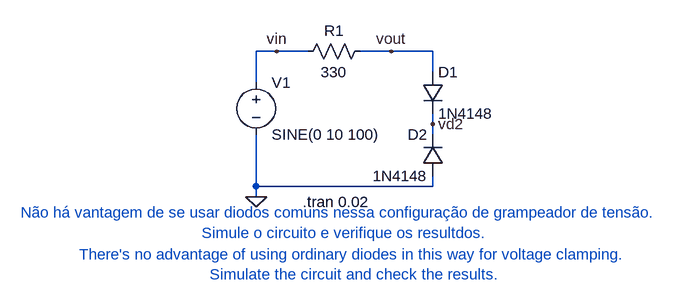
[diagram p0: schematic diodes_bad_voltage_clamp.asc]
diodes_bad_voltage_clamp.asc, the LTspice schematic file:
Version 4
SHEET 1 936 680
WIRE 112 48 80 48
WIRE 160 48 112 48
WIRE 288 48 240 48
WIRE 352 48 288 48
WIRE 352 80 352 48
WIRE 80 96 80 48
WIRE 352 160 352 144
WIRE 352 176 352 160
WIRE 80 256 80 176
WIRE 352 256 352 240
WIRE 352 256 80 256
WIRE 80 272 80 256
FLAG 80 272 0
FLAG 112 48 vin
FLAG 288 48 vout
FLAG 352 160 vd2
SYMBOL voltage 80 80 R0
WINDOW 123 0 0 Left 0
WINDOW 39 0 0 Left 0
SYMATTR InstName V1
SYMATTR Value SINE(0 10 100)
SYMBOL res 256 32 R90
WINDOW 0 0 56 VBottom 2
WINDOW 3 32 56 VTop 2
SYMATTR InstName R1
SYMATTR Value 330
SYMBOL diode 336 80 R0
SYMATTR InstName D1
SYMATTR Value 1N4148
SYMBOL diode 368 240 R180
WINDOW 0 24 64 Left 2
WINDOW 3 24 0 Left 2
SYMATTR InstName D2
SYMATTR Value 1N4148
TEXT 152 280 Left 2 !.tran 0.02
TEXT 216 312 Center 2 ;Não há vantagem de se usar diodos comuns nessa configuração de grampeador de tensão. \nSimule o circuito e verifique os resultdos.
TEXT 232 376 Center 2 ;There's no advantage of using ordinary diodes in this way for voltage clamping.\nSimulate the circuit and check the results.

The netlist it stands for:
* diodes_bad_voltage_clamp.asc
V1 vin 0 SINE(0 10 100)
R1 vout vin 330
D1 vout vd2 1N4148
D2 0 vd2 1N4148
.model D D
.lib standard.dio
.tran 0.02
* Não há vantagem de se usar diodos comuns nessa configuração de grampeador de tensão.
* Simule o circuito e verifique os resultdos.
* There's no advantage of using ordinary diodes in this way for voltage clamping.
* Simulate the circuit and check the results.
.backanno
.end